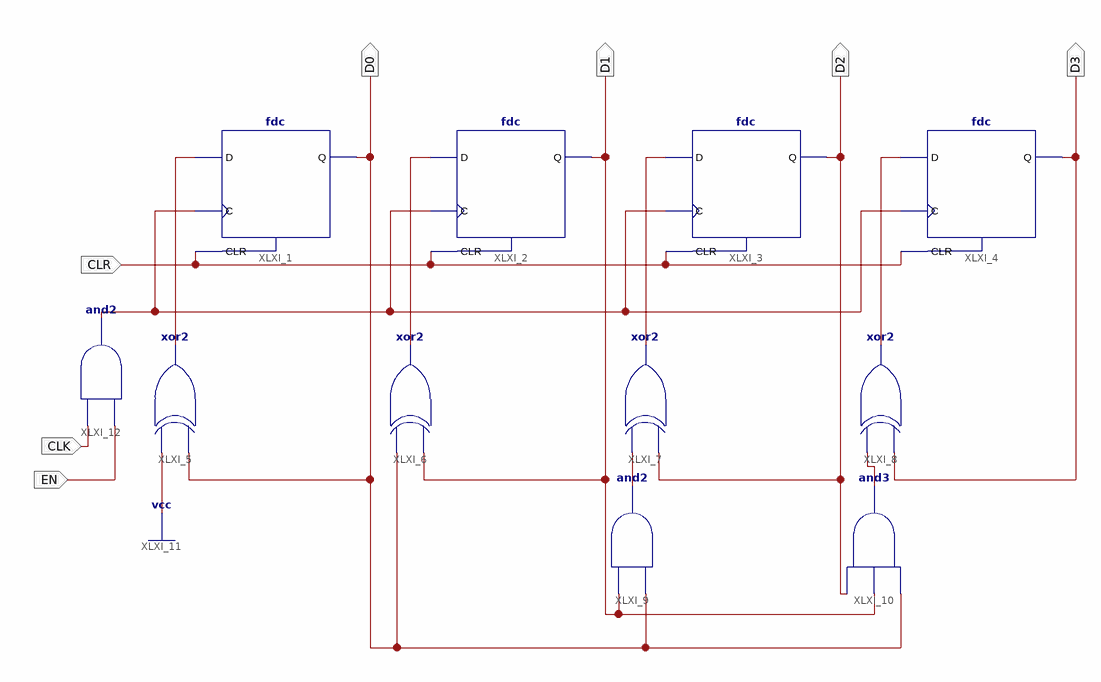
[diagram p0: schematic sheet 1]
// Xilinx ISE schematic counter163.sch (spartan3e) as structural Verilog: 11 symbols, 7 ports
module counter163 (
  input  CLR,
  input  CLK,
  input  EN,
  output D0,
  output D1,
  output D2,
  output D3
);

  wire CLK1, XLXN_6, XLXN_9, XLXN_15, XLXN_17, XLXN_18, XLXN_20;

  fdc XLXI_1 (.C(CLK1), .CLR(CLR), .D(XLXN_6), .Q(D0));
  fdc XLXI_2 (.C(CLK1), .CLR(CLR), .D(XLXN_17), .Q(D1));
  fdc XLXI_3 (.C(CLK1), .CLR(CLR), .D(XLXN_18), .Q(D2));
  fdc XLXI_4 (.C(CLK1), .CLR(CLR), .D(XLXN_20), .Q(D3));
  xor XLXI_5 (XLXN_6, D0, 1'b1);
  xor XLXI_6 (XLXN_17, D1, D0);
  xor XLXI_7 (XLXN_18, D2, XLXN_9);
  xor XLXI_8 (XLXN_20, D3, XLXN_15);
  and XLXI_9 (XLXN_9, D0, D1);
  and XLXI_10 (XLXN_15, D0, D1, D2);
  and XLXI_12 (CLK1, EN, CLK);
endmodule
